# Altium schematic sheet Overview.SchDoc
size A4
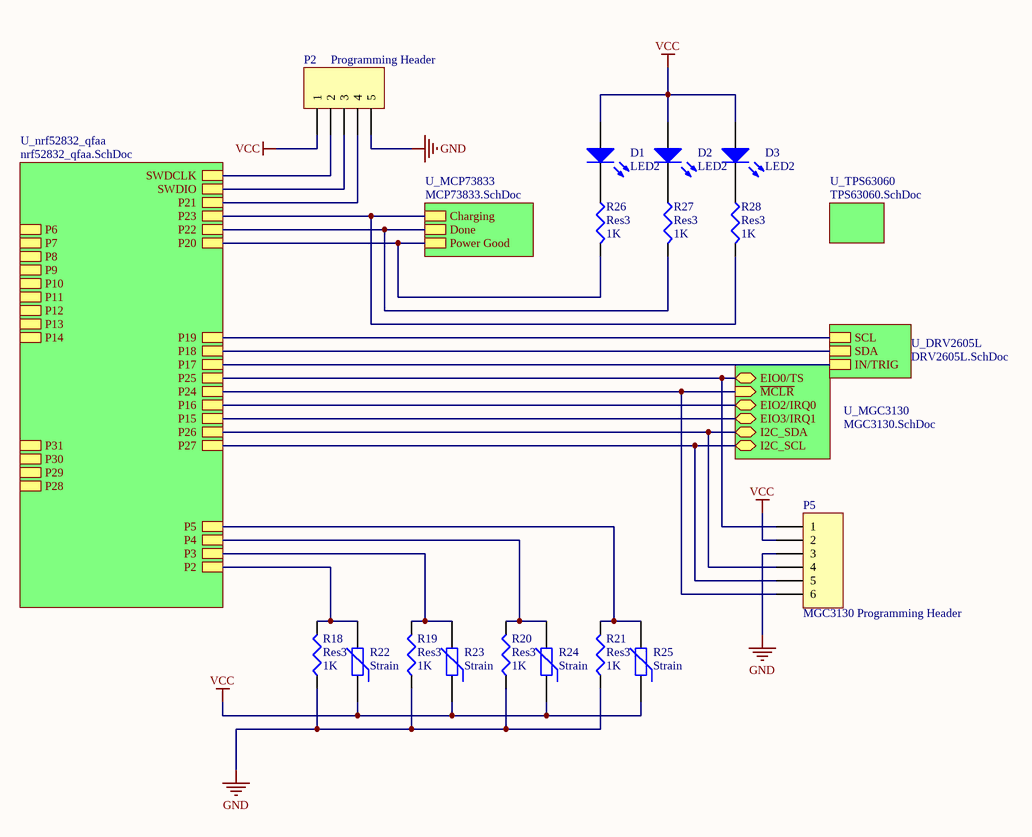
[diagram p0: Overview.SchDoc]

## Parts
D1  LED2  [3.2X1.6X1.1]
D2  LED2  [3.2X1.6X1.1]
D3  LED2  [3.2X1.6X1.1]
P2  Programming Header  [HDR1X5]
P5  MGC3130 Programming Header  [HDR1X6]
R18  Res3  value 1K  [J1-0603]
R19  Res3  value 1K  [J1-0603]
R20  Res3  value 1K  [J1-0603]
R21  Res3  value 1K  [J1-0603]
R22  Strain  [6-0805_N]
R23  Strain  [6-0805_N]
R24  Strain  [6-0805_N]
R25  Strain  [6-0805_N]
R26  Res3  value 1K  [J1-0603]
R27  Res3  value 1K  [J1-0603]
R28  Res3  value 1K  [J1-0603]

## Sub-sheets
U_DRV2605L = DRV2605L.SchDoc: SCL, SDA, IN/TRIG
U_MCP73833 = MCP73833.SchDoc: Charging, Done, Power Good
U_MGC3130 = MGC3130.SchDoc: EIO0/TS (bidir), ~{MCLR} (in), EIO2/IRQ0 (bidir), EIO3/IRQ1 (bidir), I2C_SDA (bidir), I2C_SCL (bidir)
U_nrf52832_qfaa = nrf52832_qfaa.SchDoc: P2, P3, P4, P5, P6, P7, P8, P9, P10, P11, P12, P13, P14, P15, P16, P17, P18, P19, P20, P21, P31, P30, P29, P28, P27, P24, P23, P22, SWDIO, SWDCLK, P26, P25
U_TPS63060 = TPS63060.SchDoc: no entries

## Nets
GND: P2.5 P5.3 R18.1 R19.1 R20.1 R21.1
VCC: D1.1(A) D2.1(A) D3.1(A) P2.1 P5.2 R22.1 R23.1 R24.1 R25.1
NetD1_2: D1.2(K) R26.1
NetD2_2: D2.2(K) R27.1
NetD3_2: D3.2(K) R28.1
NetP2_2: P2.2 ; sheet U_nrf52832_qfaa/SWDCLK
NetP2_3: P2.3 ; sheet U_nrf52832_qfaa/SWDIO
NetP2_4: P2.4 ; sheet U_nrf52832_qfaa/P21
NetP5_1: P5.1 ; sheet U_MGC3130/EIO0/TS, sheet U_nrf52832_qfaa/P25
NetP5_4: P5.4 ; sheet U_MGC3130/I2C_SDA, sheet U_nrf52832_qfaa/P26
NetP5_5: P5.5 ; sheet U_MGC3130/I2C_SCL, sheet U_nrf52832_qfaa/P27
NetP5_6: P5.6 ; sheet U_MGC3130/~{MCLR}, sheet U_nrf52832_qfaa/P24
NetR18_2: R18.2 R22.2 ; sheet U_nrf52832_qfaa/P2
NetR19_2: R19.2 R23.2 ; sheet U_nrf52832_qfaa/P3
NetR20_2: R20.2 R24.2 ; sheet U_nrf52832_qfaa/P4
NetR21_2: R21.2 R25.2 ; sheet U_nrf52832_qfaa/P5
NetR26_2: R26.2 ; sheet U_MCP73833/Power Good, sheet U_nrf52832_qfaa/P20
NetR27_2: R27.2 ; sheet U_MCP73833/Done, sheet U_nrf52832_qfaa/P22
NetR28_2: R28.2 ; sheet U_MCP73833/Charging, sheet U_nrf52832_qfaa/P23
(unnamed): sheet U_MGC3130/EIO2/IRQ0, sheet U_nrf52832_qfaa/P16
(unnamed): sheet U_MGC3130/EIO3/IRQ1, sheet U_nrf52832_qfaa/P15
(unnamed): sheet U_DRV2605L/SCL, sheet U_nrf52832_qfaa/P19
(unnamed): sheet U_DRV2605L/SDA, sheet U_nrf52832_qfaa/P18
(unnamed): sheet U_DRV2605L/IN/TRIG, sheet U_nrf52832_qfaa/P17

## Library data of the parts
D1-D3 = LED2: Typical RED, GREEN, YELLOW, AMBER GaAs LED; Published: 8-Jun-2000; LatestRevisionDate: 17-Jul-2002; LatestRevisionNote: Re-released for DXP Platform.; PackageVersion: Feb-2002; PackageReference: 3.2X1.6X1.1; Publisher: Altium Limited; PackageDescription: SM LED; 2 Flat Leads
P2 = Header 5: Header, 5-Pin; LatestRevisionDate: 17-Jul-2002; LatestRevisionNote: Re-released for DXP Platform.; Publisher: Altium Limited
P5 = Header 6: Header, 6-Pin; LatestRevisionDate: 17-Jul-2002; LatestRevisionNote: Re-released for DXP Platform.; Publisher: Altium Limited
R18-R21 R26-R28 = Res3: Resistor; Published: 8-Jun-2000; LatestRevisionDate: 29-May-2009; LatestRevisionNote: IPC-7351 Footprint Added.; PackageReference: J1-0603; Publisher: Altium Limited; PackageDescription: Chip Resistor
R22-R25 = Res Varistor: Varistor (Voltage-Sensitive Resistor); Published: 24-Mar-1999; LatestRevisionDate: 29-May-2009; LatestRevisionNote: IPC-7351 Footprint Added.; PackageVersion: Mar-2003; PackageReference: 6-0805; Publisher: Altium Limited; PackageDescription: Chip Resistor 0805 Case Size; Code_IPC: RESC2012